# Altium project SpaceVNXDaughterBoard.PrjPcb
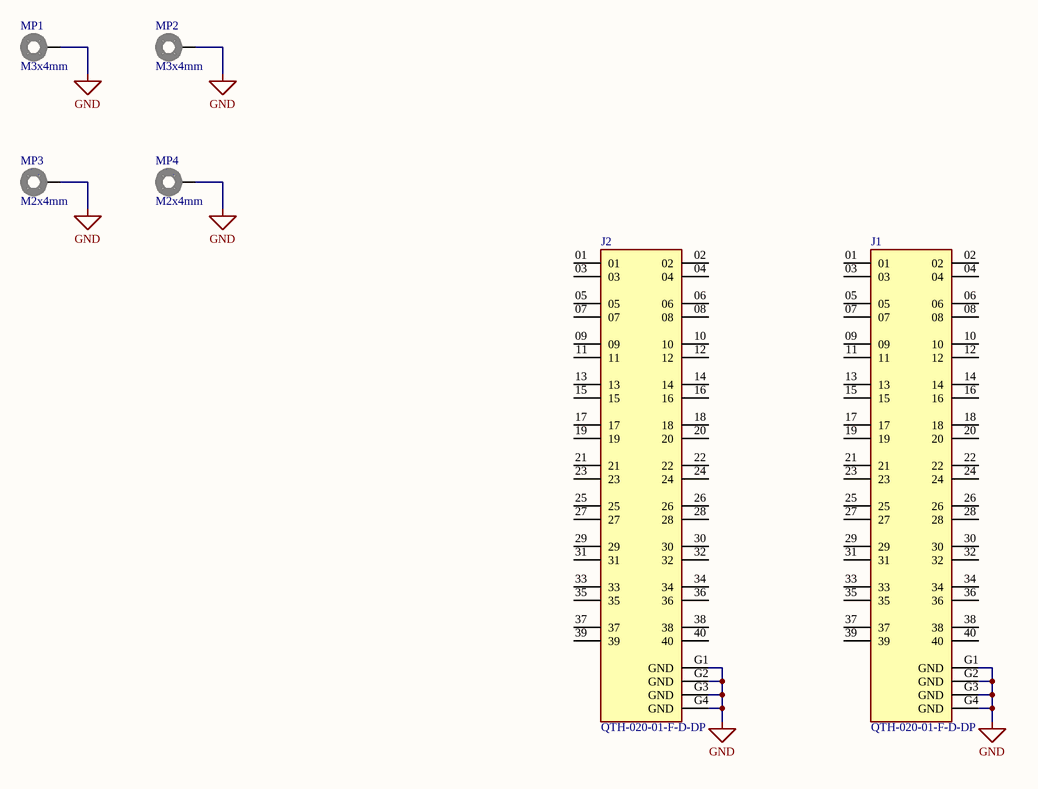
[diagram p0: SpaceVNXDaughterBoard.SchDoc]
1 sheet, 6 parts. Net scope: global (net labels, ports and power ports of the same name join across sheets).
Board file: SpaceVNXDaughterBoard.PcbDoc

## Sheet SpaceVNXDaughterBoard.SchDoc: SpaceVNXDaughterBoard
size A3; Author: Carlos Barreiro; Organization: Escuela Técnica Superior de Ingeniería de Sistemas Informáticos de la Universidad Politécnica de Madrid; Address1: Campus Sur de la Universidad Politécnica de Madrid; Address2: Calle de Alan Turing, s/nº; Address3: Madrid 28031; Address4: España; Revision: 1.0; SheetNumber: 1; SheetTotal: 1

### Parts
J1  QTH-020-01-F-D-DP  [SAMTEC_QTH-020-01-X-D-DP-A]
J2  QTH-020-01-F-D-DP  [SAMTEC_QTH-020-01-X-D-DP-A]
MP1  M3x4mm  [90910A572]
MP2  M3x4mm  [90910A572]
MP3  M2x4mm  [90910A572]
MP4  M2x4mm  [90910A572]

### Nets
GND: J1.G1(GND) J1.G2(GND) J1.G3(GND) J1.G4(GND) J2.G1(GND) J2.G2(GND) J2.G3(GND) J2.G4(GND) MP1.1 MP2.1 MP3.1 MP4.1

Not connected (* = marked no-connect by the designer): J1 01 02 03 04 05 06 07 08 09 10 11 12 13 14 15 16 17 18 19 20 21 22 23 24 25 26 27 28 29 30 31 32 33 34 35 36 37 38 39 40; J2 01 02 03 04 05 06 07 08 09 10 11 12 13 14 15 16 17 18 19 20 21 22 23 24 25 26 27 28 29 30 31 32 33 34 35 36 37 38 39 40

### Notes on the sheet
- Project:
- Title:
- Date:
- Designer:
- Sheet
- Revision:
- of
- Commit:

### Library data of the parts
J1 J2 = QTH-020-01-F-D-DP: 0.50 mm Q Pairs® High-Speed Ground Plane Terminal Strip, Differential Pair; MF: Samtec; System: Connector; MP: QTH-020-01-F-D-DP; ComponentLink1Description: MF; ComponentLink1URL: https://www.samtec.com/products/qth-dp; Supplier 1: Digi-Key; Supplier 2: Mouser; Supplier Part Number 2: 200-QTH02001FDDP; Supplier Part Number 1: QTH-020-01-F-D-DP-ND
MP1 MP2 = 90910A572: Button Head Torx Screws 18-8 Stainless Steel, M3 x 0.5 mm Thread, 4 mm Long; ComponentLink1Description: Manufacturer; ComponentLink1URL: https://www.mcmaster.com/90910A572/
MP3 MP4 = 90910A920: Button Head Torx Screws 18-8 Stainless Steel, M2 x 0.4mm Thread, 4mm Long; ComponentLink1Description: Manufacturer; ComponentLink1URL: https://www.mcmaster.com/90910A920/